# Altium schematic sheet Projekt91.SchDoc
size A3
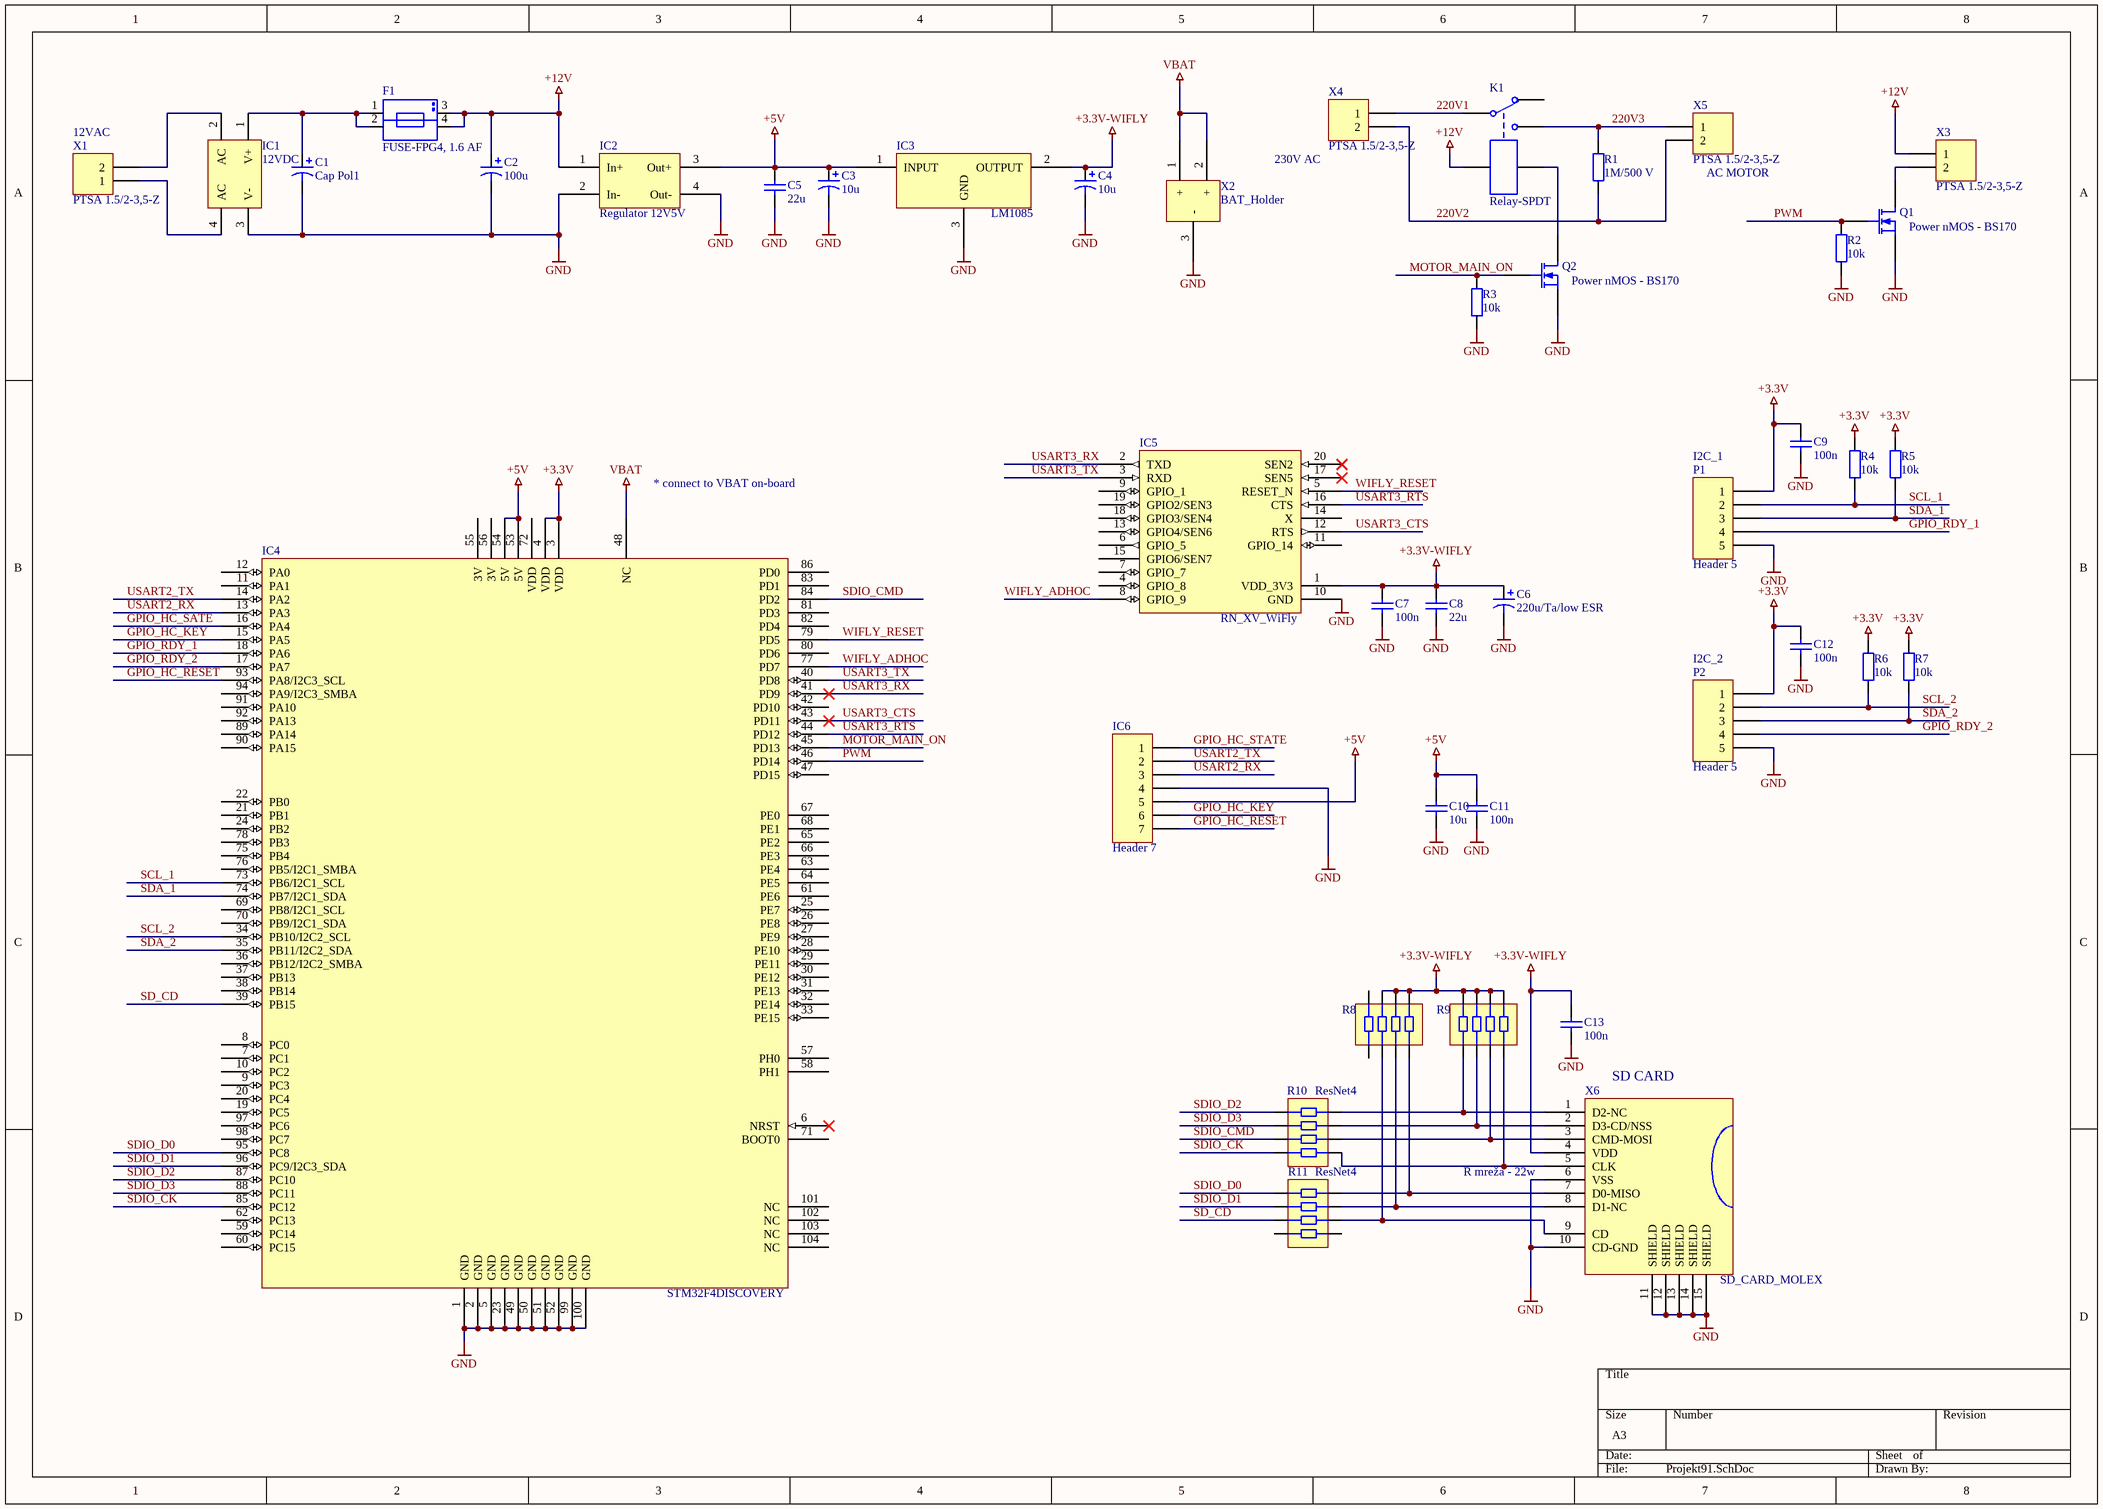
[diagram p0: Projekt91.SchDoc]

## Parts
C1  Cap Pol1  [rad-5]
C2  100u  [RAD-3.5]
C3  10u  [C0805]
C4  10u  [C0805]
C5  22u  [C0805]
C6  220u/Ta/low ESR  [D_case]
C7  100n  [C0805]
C8  22u  [C0805]
C9  100n  [C0805]
C10  10u  [c0805]
C11  100n  [C0805]
C12  100n  [C0805]
C13  100n  [C0805]
F1  FUSE-FPG4, 1.6 AF  [FUSE-FPG4]
IC1  12VDC  [graetz2]
IC2  Regulator 12V5V  [regulator]
IC3  LM1085  [TO-220]
IC4  STM32F4DISCOVERY  [STM32F4DISC_BACK]
IC5  RN_XV_WiFly  [RN-XV]
IC6  Header 7  [HDR1X7]
K1  Relay-SPDT  [relay]
P1  Header 5  [HDR1X5]
P2  Header 5  [HDR1X5]
Q1  Power nMOS - BS170  [to-92]
Q2  Power nMOS - BS170  [to-92]
R1  1M/500 V  [AXIAL-0.4]
R2  10k  [C0805]
R3  10k  [C0805]
R4  10k  [C0805]
R5  10k  [C0805]
R6  10k  [C0805]
R7  10k  [C0805]
R8  ResNet4  [resnet4]  (value not drawn)
R9  ResNet4  [resnet4]  (value not drawn)
R10  ResNet4  [resnet4]
R11  ResNet4  [resnet4]
X1  PTSA 1.5/2-3,5-Z  [PTSA_2.5MM_x2]
X2  BAT_Holder  [BAT_Holder]
X3  PTSA 1.5/2-3,5-Z  [PTSA_2.5MM_x2]
X4  PTSA 1.5/2-3,5-Z  [PTSA_2.5MM_x2]
X5  PTSA 1.5/2-3,5-Z  [PTSA_2.5MM_x2]
X6  SD_CARD_MOLEX  [MOLEX-MICROSD-503182-1853]

## Nets
+3.3V: C9.2 C12.2 IC4.3(VDD) IC4.4(VDD) P1.1 P2.1 R4.1 R5.1 R6.1 R7.1
+3.3V-WIFLY: C4.1 C6.1 C7.2 C8.2 C13.2 IC3.2(OUTPUT) IC5.1(VDD_3V3) R8.6 R8.7 R8.8 R9.5 R9.6 R9.7 R9.8 X6.4(VDD)
+5V: C3.1 C5.2 C10.2 C11.2 IC2.3(Out+) IC3.1(INPUT) IC4.53(5V) IC4.54(5V) IC6.5
+12V: C2.1 F1.3 F1.4 IC2.1(In+) K1.4 X3.1
GND: C1.2 C2.2 C3.2 C4.2 C5.1 C6.2 C7.1 C8.1 C9.1 C10.1 C11.1 C12.1 C13.1 IC1.3(V-) IC2.2(In-) IC2.4(Out-) IC3.3(GND) IC4.1(GND) IC4.2(GND) IC4.5(GND) IC4.23(GND) IC4.49(GND) IC4.50(GND) IC4.51(GND) IC4.52(GND) IC4.99(GND) IC4.100(GND) IC5.10(GND) IC6.4 P1.5 P2.5 Q1.3(S) Q2.3(S) R2.2 R3.2 X2.3(-) X6.6(VSS) X6.10(CD-GND) X6.11(SHIELD) X6.12(SHIELD) X6.13(SHIELD) X6.14(SHIELD) X6.15(SHIELD)
VBAT: IC4.48(NC) X2.1(+) X2.2(+)
220V1: K1.1 X4.1
220V2: R1.2 X4.2 X5.2
220V3: K1.3 R1.1 X5.1
GPIO_HC_KEY: IC4.15(PA5) IC6.6
GPIO_HC_RESET: IC4.93(PA8/I2C3_SCL) IC6.7
GPIO_HC_SATE: IC4.16(PA4)
GPIO_HC_STATE: IC6.1
GPIO_RDY_1: IC4.18(PA6) P1.4
GPIO_RDY_2: IC4.17(PA7) P2.4
MOTOR_MAIN_ON: IC4.45(PD13) Q2.2(G) R3.1
PWM: IC4.46(PD14) Q1.2(G) R2.1
SCL_1: IC4.73(PB6/I2C1_SCL) P1.2 R4.2
SCL_2: IC4.34(PB10/I2C2_SCL) P2.2 R6.2
SD_CD: IC4.39(PB15) R11.2
SDA_1: IC4.74(PB7/I2C1_SDA) P1.3 R5.2
SDA_2: IC4.35(PB11/I2C2_SDA) P2.3 R7.2
SDIO_CK: IC4.85(PC12) R10.1
SDIO_CMD: IC4.84(PD2) R10.2
SDIO_D0: IC4.95(PC8) R11.4
SDIO_D1: IC4.96(PC9/I2C3_SDA) R11.3
SDIO_D2: IC4.87(PC10) R10.4
SDIO_D3: IC4.88(PC11) R10.3
USART2_RX: IC4.13(PA3) IC6.3
USART2_TX: IC4.14(PA2) IC6.2
USART3_CTS: IC4.43(PD11) IC5.12(RTS)
USART3_RTS: IC4.44(PD12) IC5.16(CTS)
USART3_RX: IC4.41(PD9) IC5.2(TXD)
USART3_TX: IC4.40(PD8) IC5.3(RXD)
WIFLY_ADHOC: IC4.77(PD7) IC5.8(GPIO_9)
WIFLY_RESET: IC4.79(PD5) IC5.5(RESET_N)
NetC1_1: C1.1 F1.1 F1.2 IC1.1(V+)
NetIC1_2: IC1.2(AC) X1.2
NetIC1_4: IC1.4(AC) X1.1
NetK1_5: K1.5 Q2.1(D)
NetQ1_1: Q1.1(D) X3.2
NetR8_2: R8.2 R11.6 X6.9(CD)
NetR8_3: R8.3 R11.7 X6.8(D1-NC)
NetR8_4: R8.4 R11.8 X6.7(D0-MISO)
NetR9_1: R9.1 R10.5 X6.5(CLK)
NetR9_2: R9.2 R10.6 X6.3(CMD-MOSI)
NetR9_3: R9.3 R10.7 X6.2(D3-CD/NSS)
NetR9_4: R9.4 R10.8 X6.1(D2-NC)

Not connected (* = marked no-connect by the designer): IC4 6(NRST)* 7(PC1) 8(PC0) 9(PC3) 10(PC2) 11(PA1) 12(PA0) 19(PC5) 20(PC4) 21(PB1) 22(PB0) 24(PB2) 25(PE7) 26(PE8) 27(PE9) 28(PE10) 29(PE11) 30(PE12) 31(PE13) 32(PE14) 33(PE15) 36(PB12/I2C2_SMBA) 37(PB13) 38(PB14) 42(PD10) 47(PD15) 55(3V) 56(3V) 57(PH0) 58(PH1) 59(PC14) 60(PC15) 61(PE6) 62(PC13) 63(PE4) 64(PE5) 65(PE2) 66(PE3) 67(PE0) 68(PE1) 69(PB8/I2C1_SCL) 70(PB9/I2C1_SDA) 71(BOOT0) 72(VDD) 75(PB4) 76(PB5/I2C1_SMBA) 78(PB3) 80(PD6) 81(PD3) 82(PD4) 83(PD1) 86(PD0) 89(PA14) 90(PA15) 91(PA10) 92(PA13) 94(PA9/I2C3_SMBA) 97(PC6) 98(PC7) 101(NC) 102(NC) 103(NC) 104(NC); IC5 4(GPIO_8) 6(GPIO_5) 7(GPIO_7) 9(GPIO_1) 11(GPIO_14) 13(GPIO4/SEN6) 14(X) 15(GPIO6/SEN7) 17(SEN5)* 18(GPIO3/SEN4) 19(GPIO2/SEN3) 20(SEN2)*; K1 2; R8 1 5; R11 1 5

## Notes on the sheet
- (near X1) 12VAC
- 230V AC
- (near X5) AC MOTOR
- * connect to VBAT on-board
- (near P1) I2C_1
- (near P2) I2C_2
- (near X6) SD CARD
- (near X6) R mreža - 22w

## Library data of the parts
C1 = Cap Pol1: Polarized Capacitor (Radial); Dobavljac: Farnell; Kataloski broj: 8767165
C2 = Cap Pol1: Polarized Capacitor (Radial); Dobavljac: Farnell; Kataloski broj: 8766924
C3 C4 = Cap Pol3: Polarized Capacitor (Surface Mount); Dobavljac: Farnell; Kataloski broj: 1797010
C5 = Cap: Capacitor; Kataloski broj: 1867955; Dobavljac: Farnell
C6 = Cap Pol1: Polarized Capacitor (Radial); Dobavljac: Farnell; Kataloski broj: 1672651
C7 C11 = Cap: Capacitor; Dobavljac: Farnell; Kataloski broj: 3019949
C8 = Cap: Capacitor; Dobavljac: Farnell; Kataloski broj: 1867955
C9 C12 C13 = Cap: Capacitor; Kataloski broj: 3019949; Dobavljac: Farnell
C10 = Cap: Capacitor; Dobavljac: Farnell; Kataloski broj: 1797010
F1 = FUSE-FPG4: Dobavljac: Schuricht; Kataloski broj: 270-186
IC1 = Bridge2: Diode Bridge; Dobavljac: Farnell; Kataloski broj: 1702788
IC2 = Regulator: Dobavljac: Rec; Kataloski broj: 1
IC3 = LM1085: Dobavljac: Farnell; Kataloski broj: 1469041
IC4 = STM32F4DISC_w/o[101..106]: Dobavljac: Farnell; Kataloski broj: 2009276
IC5 = RN_XV_WiFly: Dobavljac: Farnell; Kataloski broj: 2144011
IC6 = Header 7: Header, 7-Pin
K1 = Relay-SPDT: Single-Pole Dual-Throw Relay; Dobavljac: Farnell; Kataloski broj: 1094019
P1 P2 = Header 5: Header, 5-Pin
Q1 Q2 = MOSFET-N: N-Channel MOSFET; Dobavljac: Farnell; Kataloski broj: 1017687
R1 = Res2: Resistor; Dobavljac: Chipoteka; Kataloski broj: 2210127001
R2-R7 = Res2: Resistor; Dobavljac: Farnell; Kataloski broj: 2331808
R8-R11 = ResNet4: Dobavljac: Farnell; Kataloski broj: 2060086
X1 X3-X5 = Header 2: Header, 2-Pin; Dobavljac: Farnell; Kataloski broj: 1792769
X2 = BAT_Holder: Dobavljac: Farnell; Kataloski broj: 1319749
X6 = SD_CARD_MOLEX: Dobavljac: Farnell; Kataloski broj: 2334075